# Altium schematic sheet BalEv_FPTG_IO_v1_0.SchDoc
size A4; CompanyName: HESSO; Address1: Route du Rawyl 47; Address2: 1950 Sion; Address3: Switzerland; DocumentNumber: 5; SheetNumber: 8; SheetTotal: 9; PageSetup: Record=PageOptions|CenterHorizontal=True|CenterVertical=True|PrintScale=1.00|XCorrection=1.00|YCorrection=1.00|PrintKind=1|BorderSize=5000000|LeftOffset=0|BottomOffset=0|Orientation=2|PaperLength=1000|PaperWidth=1000|Scale=100|PaperSource=15|PrintQuality=1200|MediaType=1|DitherType=10|PrintScaleMode=1|PaperKind=A4|PaperIndex=9; ProjectName: Project Name
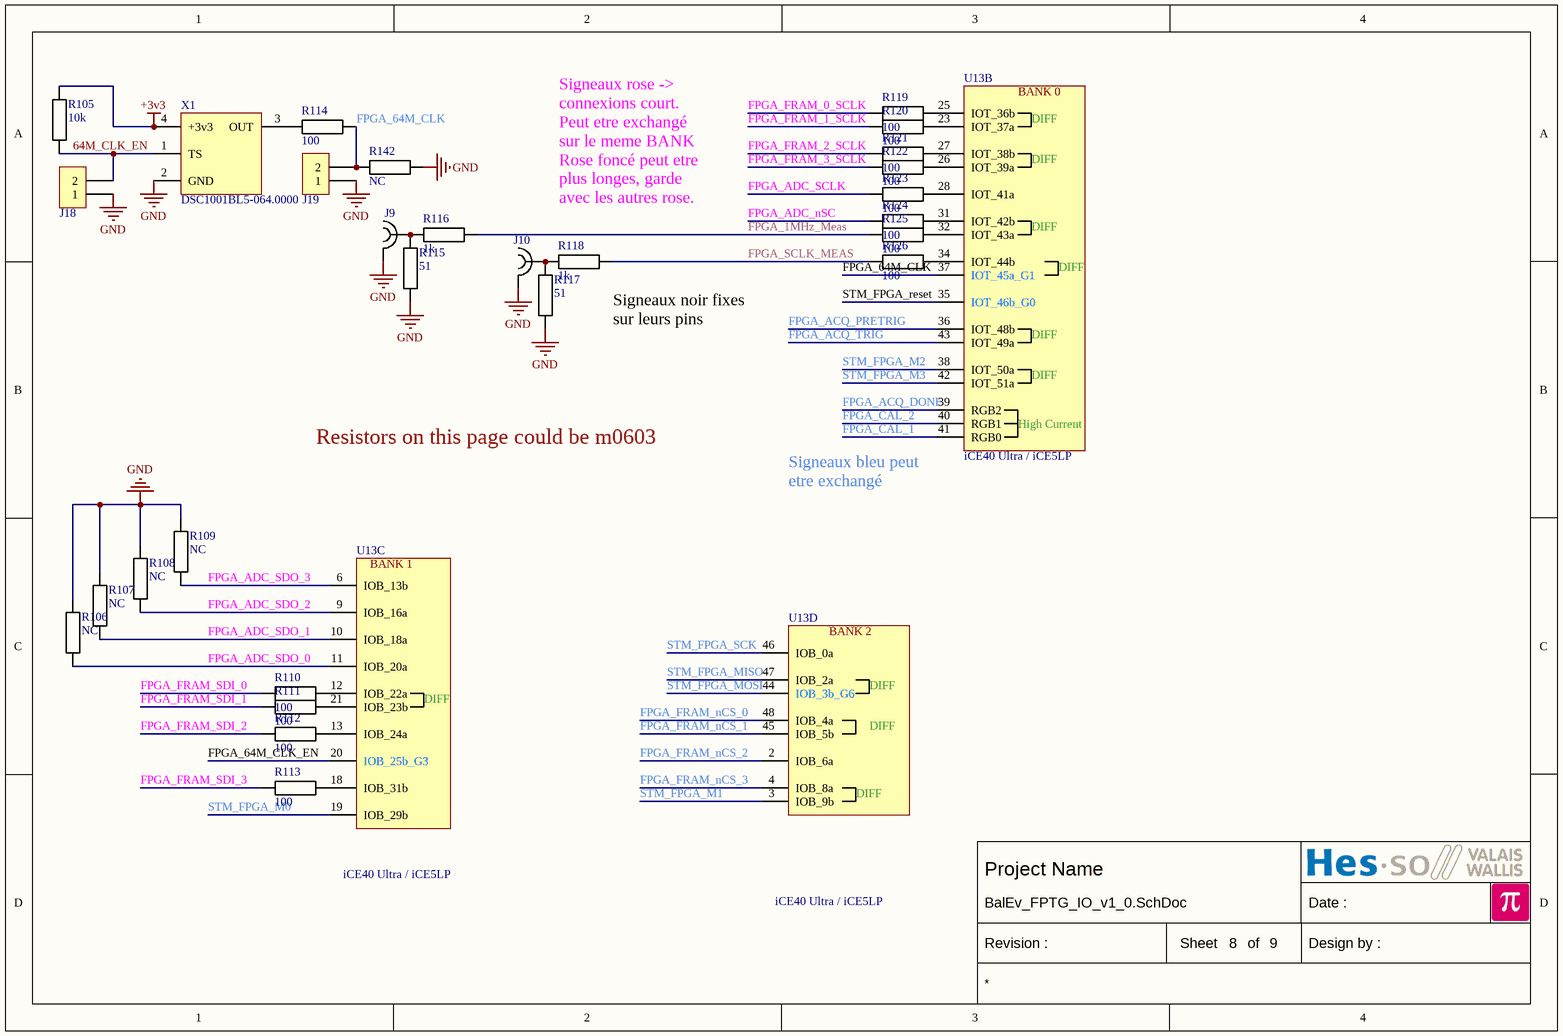
[diagram p0: BalEv_FPTG_IO_v1_0.SchDoc]

## Parts
J9  CONSMA001-SMD-G  [SMA SMD Vertical Linx CONSMA001-SMD-G]  (value not drawn)
J10  CONSMA001-SMD-G  [SMA SMD Vertical Linx CONSMA001-SMD-G]  (value not drawn)
J18  *  [PinHeader1x2 P2.54]  (value not drawn)
J19  *  [PinHeader1x2 P1.27]  (value not drawn)
R105  10k  [RESISTOR 1005 REFLOW]
R106  NC  [RESISTOR 1005 REFLOW]
R107  NC  [RESISTOR 1005 REFLOW]
R108  NC  [RESISTOR 1005 REFLOW]
R109  NC  [RESISTOR 1005 REFLOW]
R110  100  [RESISTOR 1005 REFLOW]
R111  100  [RESISTOR 1005 REFLOW]
R112  100  [RESISTOR 1005 REFLOW]
R113  100  [RESISTOR 1005 REFLOW]
R114  100  [RESISTOR 1005 REFLOW]
R115  51  [RESISTOR 1005 REFLOW]
R116  1k  [RESISTOR 1005 REFLOW]
R117  51  [RESISTOR 1005 REFLOW]
R118  1k  [RESISTOR 1005 REFLOW]
R119  100  [RESISTOR 1005 REFLOW]
R120  100  [RESISTOR 1005 REFLOW]
R121  100  [RESISTOR 1005 REFLOW]
R122  100  [RESISTOR 1005 REFLOW]
R123  100  [RESISTOR 1005 REFLOW]
R124  100  [RESISTOR 1005 REFLOW]
R125  100  [RESISTOR 1005 REFLOW]
R126  100  [RESISTOR 1005 REFLOW]
R142  NC  [RESISTOR 1005 REFLOW]
U13  iCE40 Ultra / iCE5LP  [QFN50P700X700X100_HS-49N]  (parts B,C,D of 4)
X1  DSC1001BL5-064.0000  [Oscillator C5.0x3.2 Abracon ASFL1]

## Nets
+3v3: R105.2 X1.4(+3v3)
GND: J9.2 J10.2 J18.1 J19.1 R106.1 R107.1 R108.1 R109.1 R115.2 R117.2 R142.1 X1.2(GND)
64M_CLK_EN: J18.2 R105.1 X1.1(TS)
FPGA_1MHz_Meas: R116.1 R125.2
FPGA_64M_CLK: J19.2 R114.1 R142.2 U13.37(IOT_45a_G1)
FPGA_64M_CLK_EN: U13.20(IOB_25b_G3)
FPGA_ACQ_DONE: U13.39(RGB2)
FPGA_ACQ_PRETRIG: U13.36(IOT_48b)
FPGA_ACQ_TRIG: U13.43(IOT_49a)
FPGA_ADC_nSC: R124.2
FPGA_ADC_SCLK: R123.2
FPGA_ADC_SDO_0: R106.2 U13.11(IOB_20a)
FPGA_ADC_SDO_1: R107.2 U13.10(IOB_18a)
FPGA_ADC_SDO_2: R108.2 U13.9(IOB_16a)
FPGA_ADC_SDO_3: R109.2 U13.6(IOB_13b)
FPGA_CAL_1: U13.41(RGB0)
FPGA_CAL_2: U13.40(RGB1)
FPGA_FRAM_0_SCLK: R119.2
FPGA_FRAM_1_SCLK: R120.2
FPGA_FRAM_2_SCLK: R121.2
FPGA_FRAM_3_SCLK: R122.2
FPGA_FRAM_nCS_0: U13.48(IOB_4a)
FPGA_FRAM_nCS_1: U13.45(IOB_5b)
FPGA_FRAM_nCS_2: U13.2(IOB_6a)
FPGA_FRAM_nCS_3: U13.4(IOB_8a)
FPGA_FRAM_SDI_0: R110.2
FPGA_FRAM_SDI_1: R111.2
FPGA_FRAM_SDI_2: R112.2
FPGA_FRAM_SDI_3: R113.2
FPGA_SCLK_MEAS: R118.1 R126.2
STM_FPGA_M0: U13.19(IOB_29b)
STM_FPGA_M1: U13.3(IOB_9b)
STM_FPGA_M2: U13.38(IOT_50a)
STM_FPGA_M3: U13.42(IOT_51a)
STM_FPGA_MISO: U13.47(IOB_2a)
STM_FPGA_MOSI: U13.44(IOB_3b_G6)
STM_FPGA_reset: U13.35(IOT_46b_G0)
STM_FPGA_SCK: U13.46(IOB_0a)
NetJ9_1: J9.1 R115.1 R116.2
NetJ10_1: J10.1 R117.1 R118.2
NetR110_1: R110.1 U13.12(IOB_22a)
NetR111_1: R111.1 U13.21(IOB_23b)
NetR112_1: R112.1 U13.13(IOB_24a)
NetR113_1: R113.1 U13.18(IOB_31b)
NetR114_2: R114.2 X1.3(OUT)
NetR119_1: R119.1 U13.25(IOT_36b)
NetR120_1: R120.1 U13.23(IOT_37a)
NetR121_1: R121.1 U13.27(IOT_38b)
NetR122_1: R122.1 U13.26(IOT_39a)
NetR123_1: R123.1 U13.28(IOT_41a)
NetR124_1: R124.1 U13.31(IOT_42b)
NetR125_1: R125.1 U13.32(IOT_43a)
NetR126_1: R126.1 U13.34(IOT_44b)

## Notes on the sheet
- Signeaux rose -> connexions court. Peut etre exchangé sur le meme BANK
  Rose foncé peut etre plus longes, garde avec les autres rose.
- (near R118) Signeaux noir fixes sur leurs pins
- Resistors on this page could be m0603
- (near U13) Signeaux bleu peut etre exchangé
- Date :
- Revision :
- Sheet
- of
- Design by :
- (in symbol ICE5LP1K-SG48, part B) BANK 0; DIFF; High Current
- (in symbol ICE5LP1K-SG48, part C) BANK 1; DIFF
- (in symbol ICE5LP1K-SG48, part D) BANK 2; DIFF

## Library data of the parts
J9 J10 = SMA SMD VERTICAL LINX CONSMA001-SMD-G: SMA TH VERTICAL LINX CONSMA001-SMD-G; Value: CONSMA001-SMD-G
J18 J19 = PinHeader1x2: Plug connector; Value: *
R105-R126 R142 = Resistor
  R105: Value: 10k
  R106-R109 R142: Value: NC
  R110-R114 R119-R126: Value: 100
  R115 R117: Value: 51
  R116 R118: Value: 1k
U13 = ICE5LP1K-SG48
X1 = Oscillator C5.0x3.2 Abracon ASFL1: Value: DSC1001BL5-064.0000